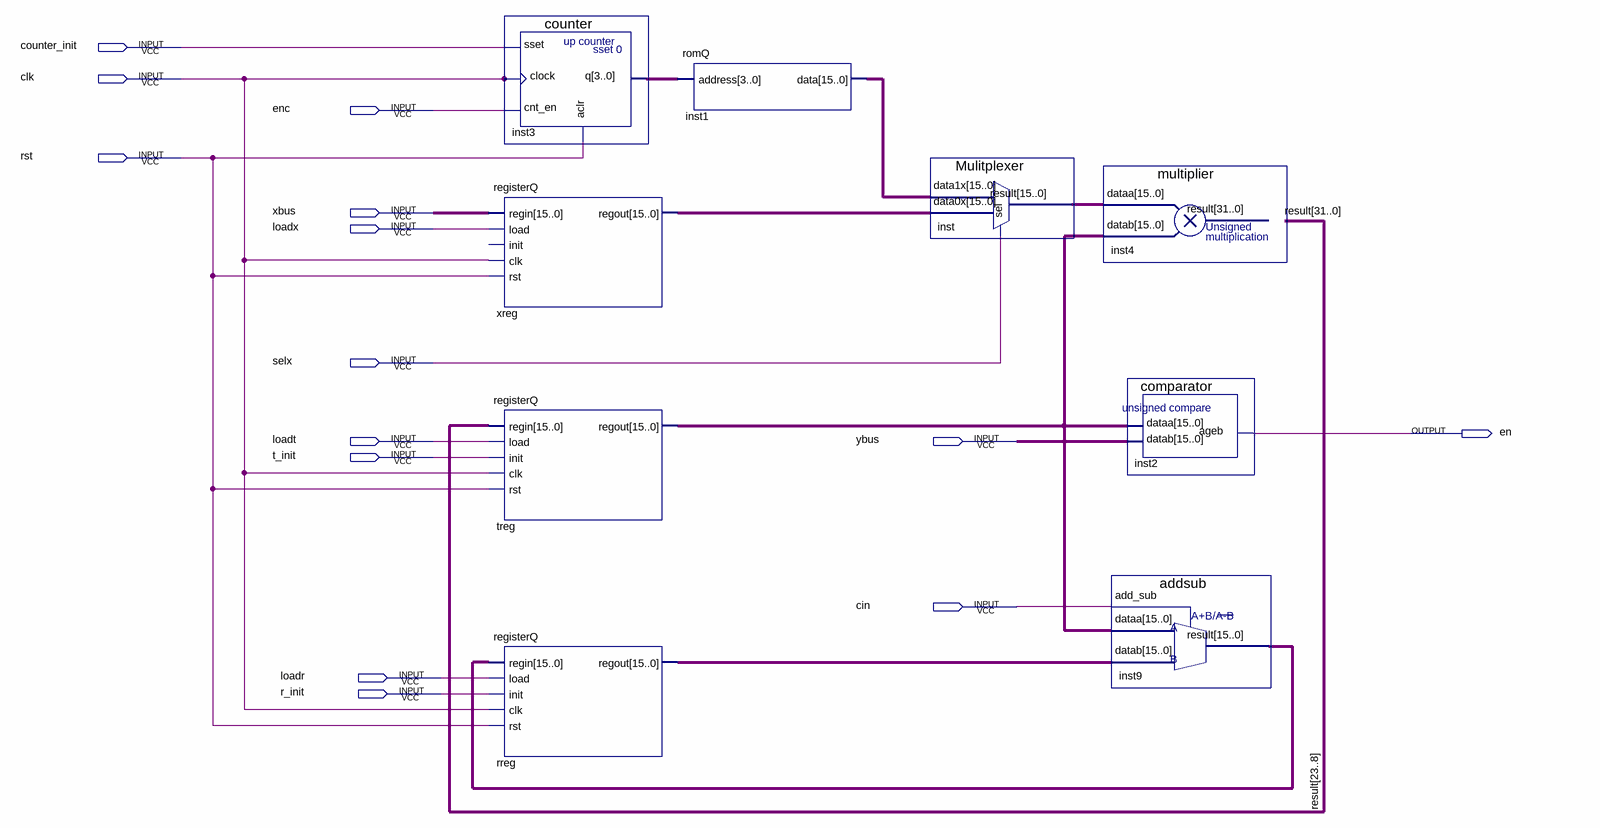
[diagram p0: schematic sheet]
// Quartus schematic datapathblock.bdf as structural Verilog: 9 symbols, 14 pins
module datapathblock (
  input  counter_init,
  input  clk,
  input  enc,
  input  rst,
  input  xbus,
  input  loadx,
  input  selx,
  input  loadt,
  input  ybus,
  input  t_init,
  input  cin,
  input  loadr,
  input  r_init,
  output en
);

  wire [3:0] inst3_q;
  wire [15:0] inst1_data, inst9_result, inst_result, rreg_regout, treg_regout, undriven, undriven_2,
       xreg_regout;
  wire [31:0] result;

  counter inst3 (.sset(clk), .clock(clk), .cnt_en(clk), .aclr(rst), .q(inst3_q));
  registerQ xreg (.regin(undriven), .load(loadx), .clk(clk), .rst(rst), .regout(xreg_regout));  // open: init
  registerQ treg (.regin(result[23:8]), .load(loadt), .init(t_init), .clk(clk), .rst(rst), .regout(treg_regout));
  registerQ rreg (.regin(inst9_result), .load(loadr), .init(r_init), .clk(clk), .rst(rst), .regout(rreg_regout));
  romQ inst1 (.address(inst3_q), .data(inst1_data));
  Mulitplexer inst (.data1x(inst1_data), .data0x(xreg_regout), .sel(selx), .result(inst_result));
  multiplier inst4 (.dataa(inst_result), .datab(treg_regout), .result(result));
  comparator inst2 (.dataa(treg_regout), .datab(undriven_2), .ageb(en));
  addsub inst9 (.add_sub(cin), .dataa(treg_regout), .datab(rreg_regout), .result(inst9_result));

  assign counter_init = clk;
  assign enc = clk;
endmodule
